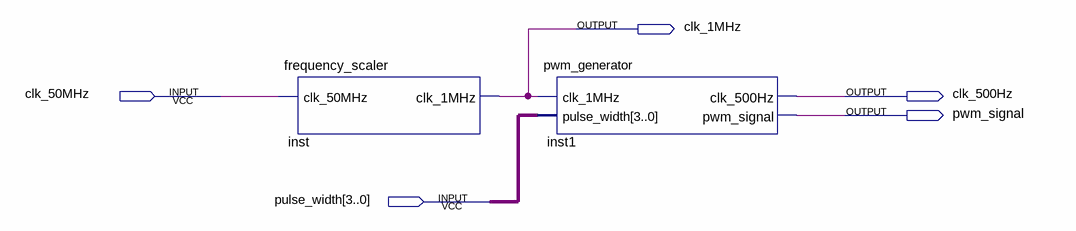
[diagram p0: schematic sheet]
// Quartus schematic t1a_fs_pwm.bdf as structural Verilog: 2 symbols, 5 pins
module t1a_fs_pwm (
  input  clk_50MHz,
  input  [3:0] pulse_width,
  output clk_1MHz,
  output clk_500Hz,
  output pwm_signal
);

  frequency_scaler inst (.clk_50MHz(clk_50MHz), .clk_1MHz(clk_1MHz));
  pwm_generator inst1 (.clk_1MHz(clk_1MHz), .pulse_width(pulse_width), .clk_500Hz(clk_500Hz), .pwm_signal(pwm_signal));
endmodule
